# EAGLE design MP5x16_V1.0 (EAGLE 9.2.2)
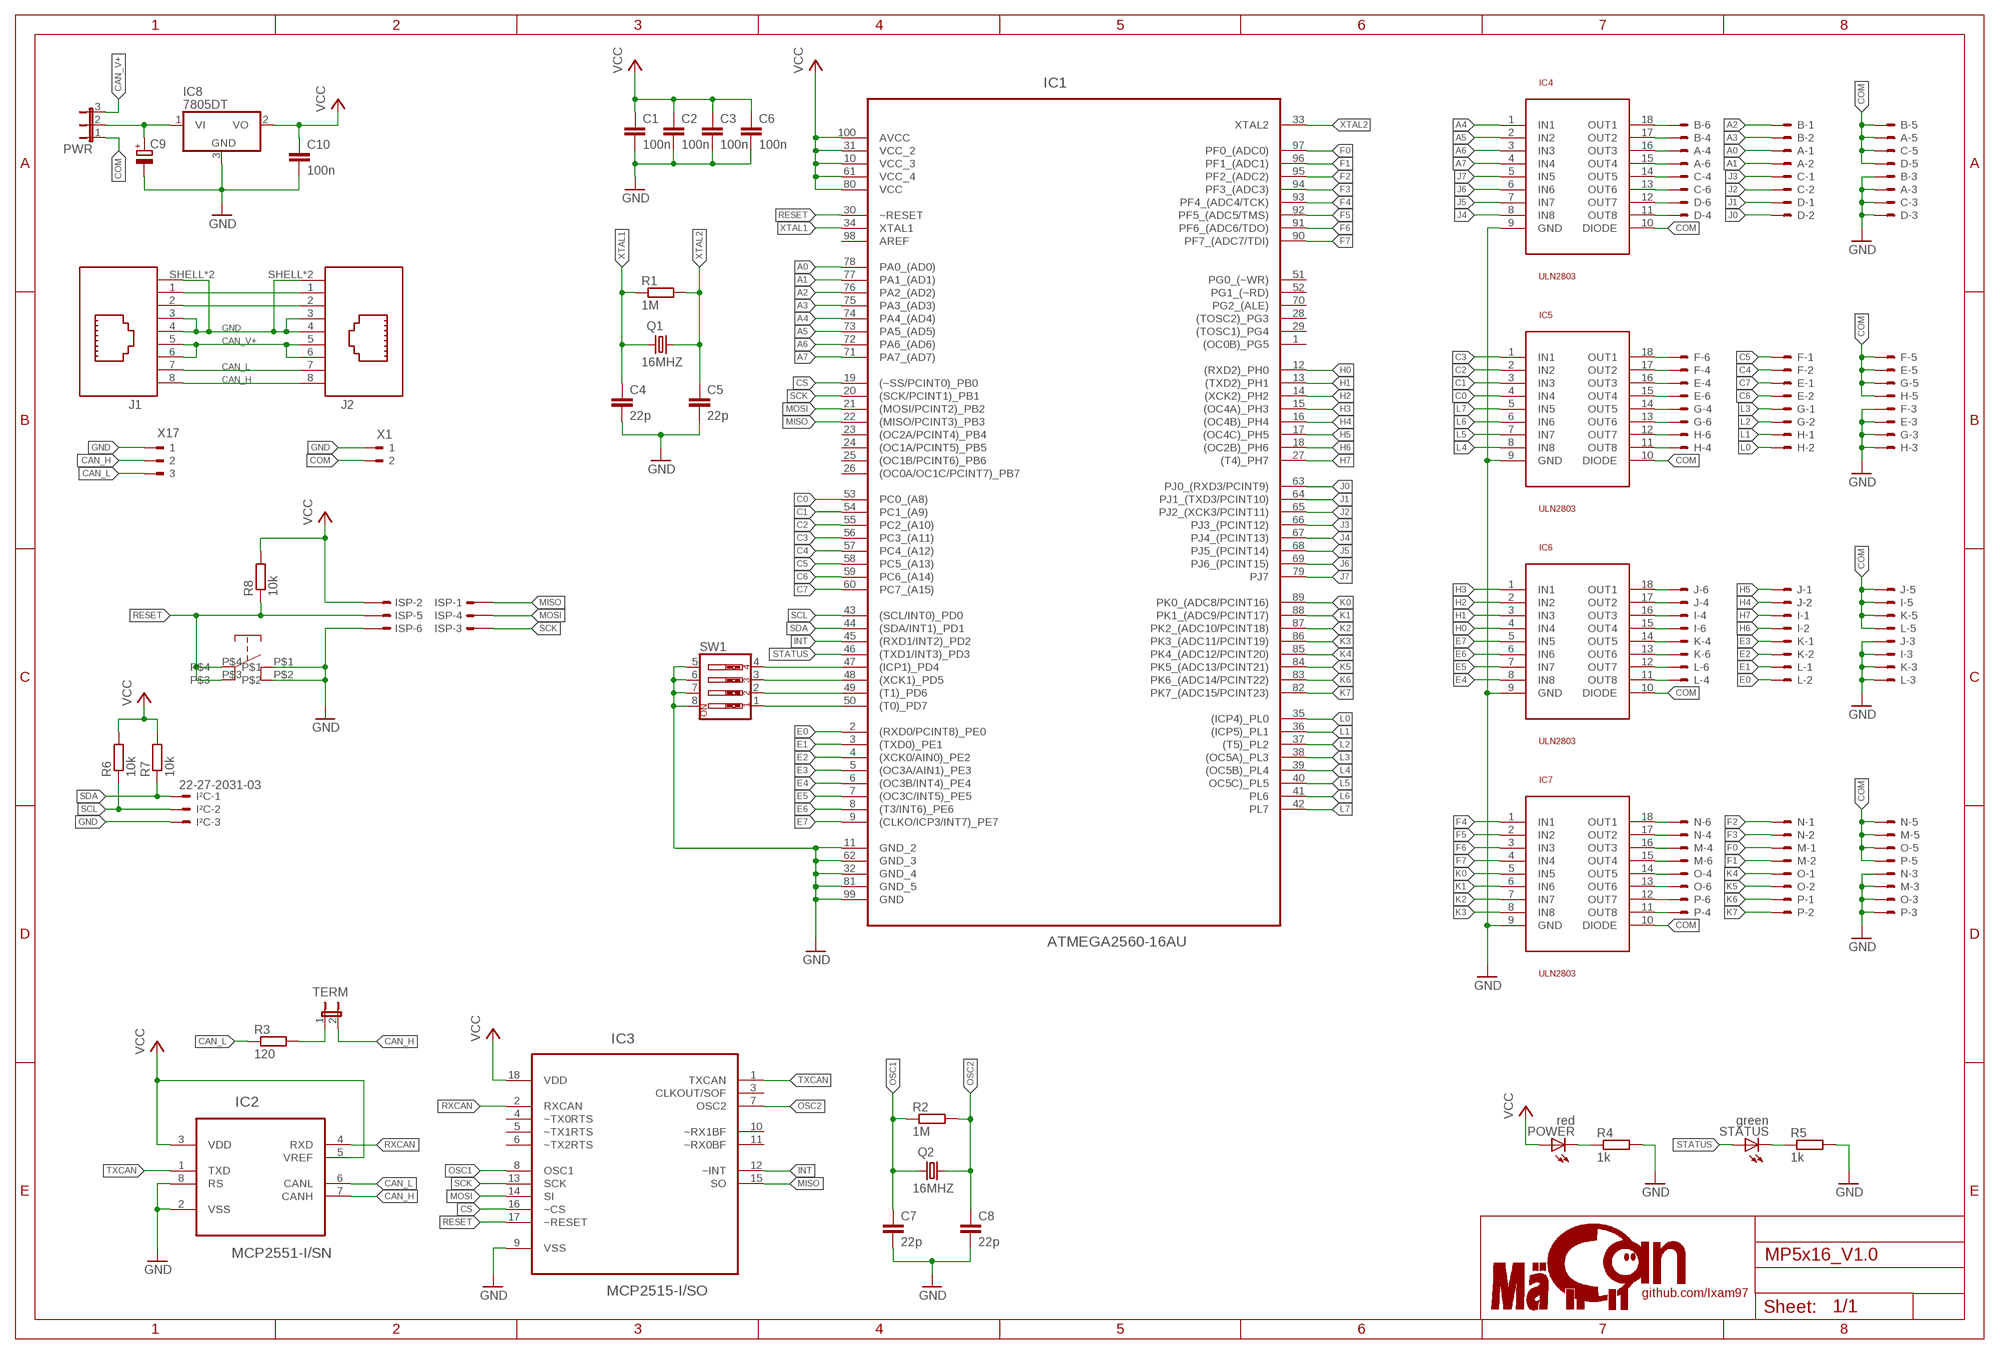
[diagram p0: schematic, sheet 1]

## Parts
A  22-27-2061-06  [6410-06]
B  22-27-2061-06  [6410-06]
C  22-27-2061-06  [6410-06]
C1  100n  C-EUC0402  [C0402]
C2  100n  C-EUC0402  [C0402]
C3  100n  C-EUC0402  [C0402]
C4  22p  C-EUC0402  [C0402]
C5  22p  C-EUC0402  [C0402]
C6  100n  C-EUC0402  [C0402]
C7  22p  C-EUC0402  [C0402]
C8  22p  C-EUC0402  [C0402]
C9  CPOL-EUCT3216  [CT3216]
C10  100n  C-EUC0402  [C0402]
D  22-27-2061-06  [6410-06]
E  22-27-2061-06  [6410-06]
F  22-27-2061-06  [6410-06]
G  22-27-2061-06  [6410-06]
H  22-27-2061-06  [6410-06]
I  22-27-2061-06  [6410-06]
IC1  ATMEGA2560-16AU  [QFP50P1600X1600X120-100N]
IC2  MCP2551-I/SN  [SOIC127P600X175-8N]
IC3  MCP2515-I/SO  [SOIC127P1034X264-18N]
IC4  ULN2803  [SO18L]
IC5  ULN2803  [SO18L]
IC6  ULN2803  [SO18L]
IC7  ULN2803  [SO18L]
IC8  7805DT  [TO252]
ISP  057-006-1  [057-006-1]
I²C  22-27-2031-03  [6410-03]
J  22-27-2061-06  [6410-06]
J1  615008140421  [615008140421]
J2  615008140421  [615008140421]
K  22-27-2061-06  [6410-06]
L  22-27-2061-06  [6410-06]
M  22-27-2061-06  [6410-06]
N  22-27-2061-06  [6410-06]
O  22-27-2061-06  [6410-06]
P  22-27-2061-06  [6410-06]
POWER  red  LEDCHIP-LED0805  [CHIP-LED0805]
PWR  JP2E  [JP2]
Q1  16MHZ  KX-7  [3.2X2.5_KX-7]
Q2  16MHZ  KX-7  [3.2X2.5_KX-7]
R1  1M  R-EU_R0402  [R0402]
R2  1M  R-EU_R0402  [R0402]
R3  120  R-EU_R0402  [R0402]
R4  1k  R-EU_R0402  [R0402]
R5  1k  R-EU_R0402  [R0402]
R6  10k  R-EU_R0402  [R0402]
R7  10k  R-EU_R0402  [R0402]
R8  10k  R-EU_R0402  [R0402]
STATUS  green  LEDCHIP-LED0805  [CHIP-LED0805]
SW1  SW_DIP-4  [EDG-04]
TERM  JP1E  [JP1]
U$1  LOGO  [LOGO]
U$15  BUTTON_JLC  [BUTTON]
X1  180-2  [180-2]
X17  180-3  [180-3]

## Nets
A0: A.1 IC1.78(PA0_(AD0))
A1: A.2 IC1.77(PA1_(AD1))
A2: B.1 IC1.76(PA2_(AD2))
A3: B.2 IC1.75(PA3_(AD3))
A4: IC1.74(PA4_(AD4)) IC4.1(IN1)
A5: IC1.73(PA5_(AD5)) IC4.2(IN2)
A6: IC1.72(PA6_(AD6)) IC4.3(IN3)
A7: IC1.71(PA7_(AD7)) IC4.4(IN4)
C0: IC1.53(PC0_(A8)) IC5.4(IN4)
C1: IC1.54(PC1_(A9)) IC5.3(IN3)
C2: IC1.55(PC2_(A10)) IC5.2(IN2)
C3: IC1.56(PC3_(A11)) IC5.1(IN1)
C4: F.2 IC1.57(PC4_(A12))
C5: F.1 IC1.58(PC5_(A13))
C6: E.2 IC1.59(PC6_(A14))
C7: E.1 IC1.60(PC7_(A15))
CAN_H: IC2.7(CANH) J1.8 J2.8 TERM.2 X17.2
CAN_L: IC2.6(CANL) J1.7 J2.7 R3.1 X17.3
CAN_V+: J1.5 J1.6 J2.5 J2.6 PWR.3
COM: A.5 B.5 C.5 D.5 E.5 F.5 G.5 H.5 I.5 IC4.10(DIODE) IC5.10(DIODE) IC6.10(DIODE) IC7.10(DIODE) J.5 K.5 L.5 M.5 N.5 O.5 P.5 PWR.1 X1.2
CS: IC1.19((~SS/PCINT0)_PB0) IC3.16(~CS)
E0: IC1.2((RXD0/PCINT8)_PE0) L.2
E1: IC1.3((TXD0)_PE1) L.1
E2: IC1.4((XCK0/AIN0)_PE2) K.2
E3: IC1.5((OC3A/AIN1)_PE3) K.1
E4: IC1.6((OC3B/INT4)_PE4) IC6.8(IN8)
E5: IC1.7((OC3C/INT5)_PE5) IC6.7(IN7)
E6: IC1.8((T3/INT6)_PE6) IC6.6(IN6)
E7: IC1.9((CLKO/ICP3/INT7)_PE7) IC6.5(IN5)
F0: IC1.97(PF0_(ADC0)) M.1
F1: IC1.96(PF1_(ADC1)) M.2
F2: IC1.95(PF2_(ADC2)) N.1
F3: IC1.94(PF3_(ADC3)) N.2
F4: IC1.93(PF4_(ADC4/TCK)) IC7.1(IN1)
F5: IC1.92(PF5_(ADC5/TMS)) IC7.2(IN2)
F6: IC1.91(PF6_(ADC6/TDO)) IC7.3(IN3)
F7: IC1.90(PF7_(ADC7/TDI)) IC7.4(IN4)
GND: A.3 B.3 C1.2 C2.2 C3.2 C4.2 C5.2 C6.2 C7.2 C8.2 C9.- C10.2 C.3 D.3 E.3 F.3 G.3 H.3 I.3 IC1.11(GND_2) IC1.32(GND_4) IC1.62(GND_3) IC1.81(GND_5) IC1.99(GND) IC2.2(VSS) IC2.8(RS) IC3.9(VSS) IC4.9(GND) IC5.9(GND) IC6.9(GND) IC7.9(GND) IC8.3(GND) ISP.6 I²C.3 J1.3 J1.4 J1.SHELL1(SHIELD) J1.SHELL(SHIELD) J2.3 J2.4 J2.SHELL1(SHIELD) J2.SHELL(SHIELD) J.3 K.3 L.3 M.3 N.3 O.3 P.3 R4.2 R5.2 SW1.5 SW1.6 SW1.7 SW1.8 U$15.P$1 U$15.P$2 X1.1 X17.1
H0: IC1.12((RXD2)_PH0) IC6.4(IN4)
H1: IC1.13((TXD2)_PH1) IC6.3(IN3)
H2: IC1.14((XCK2)_PH2) IC6.2(IN2)
H3: IC1.15((OC4A)_PH3) IC6.1(IN1)
H4: IC1.16((OC4B)_PH4) J.2
H5: IC1.17((OC4C)_PH5) J.1
H6: I.2 IC1.18((OC2B)_PH6)
H7: I.1 IC1.27((T4)_PH7)
INT: IC1.45((RXD1/INT2)_PD2) IC3.12(~INT)
J0: D.2 IC1.63(PJ0_(RXD3/PCINT9))
J1: D.1 IC1.64(PJ1_(TXD3/PCINT10))
J2: C.2 IC1.65(PJ2_(XCK3/PCINT11))
J3: C.1 IC1.66(PJ3_(PCINT12))
J4: IC1.67(PJ4_(PCINT13)) IC4.8(IN8)
J5: IC1.68(PJ5_(PCINT14)) IC4.7(IN7)
J6: IC1.69(PJ6_(PCINT15)) IC4.6(IN6)
J7: IC1.79(PJ7) IC4.5(IN5)
K0: IC1.89(PK0_(ADC8/PCINT16)) IC7.5(IN5)
K1: IC1.88(PK1_(ADC9/PCINT17)) IC7.6(IN6)
K2: IC1.87(PK2_(ADC10/PCINT18)) IC7.7(IN7)
K3: IC1.86(PK3_(ADC11/PCINT19)) IC7.8(IN8)
K4: IC1.85(PK4_(ADC12/PCINT20)) O.1
K5: IC1.84(PK5_(ADC13/PCINT21)) O.2
K6: IC1.83(PK6_(ADC14/PCINT22)) P.1
K7: IC1.82(PK7_(ADC15/PCINT23)) P.2
L0: H.2 IC1.35((ICP4)_PL0)
L1: H.1 IC1.36((ICP5)_PL1)
L2: G.2 IC1.37((T5)_PL2)
L3: G.1 IC1.38((OC5A)_PL3)
L4: IC1.39((OC5B)_PL4) IC5.8(IN8)
L5: IC1.40(OC5C)_PL5) IC5.7(IN7)
L6: IC1.41(PL6) IC5.6(IN6)
L7: IC1.42(PL7) IC5.5(IN5)
MISO: IC1.22((MISO/PCINT3)_PB3) IC3.15(SO) ISP.1
MOSI: IC1.21((MOSI/PCINT2)_PB2) IC3.14(SI) ISP.4
N$1: B.4 IC4.17(OUT2)
N$2: B.6 IC4.18(OUT1)
N$3: A.4 IC4.16(OUT3)
N$4: A.6 IC4.15(OUT4)
N$5: C.4 IC4.14(OUT5)
N$6: C.6 IC4.13(OUT6)
N$7: D.6 IC4.12(OUT7)
N$8: D.4 IC4.11(OUT8)
N$9: F.6 IC5.18(OUT1)
N$10: F.4 IC5.17(OUT2)
N$11: E.6 IC5.15(OUT4)
N$12: E.4 IC5.16(OUT3)
N$13: G.4 IC5.14(OUT5)
N$14: G.6 IC5.13(OUT6)
N$15: H.6 IC5.12(OUT7)
N$16: H.4 IC5.11(OUT8)
N$17: IC1.47((ICP1)_PD4) SW1.4
N$18: IC1.48((XCK1)_PD5) SW1.3
N$19: IC1.49((T1)_PD6) SW1.2
N$20: IC1.50((T0)_PD7) SW1.1
N$21: J1.1 J2.1
N$23: IC6.12(OUT7) L.6
N$24: IC7.12(OUT7) P.6
N$25: IC6.11(OUT8) L.4
N$26: I.4 IC6.16(OUT3)
N$27: I.6 IC6.15(OUT4)
N$28: IC6.14(OUT5) K.4
N$29: IC6.13(OUT6) K.6
N$30: IC6.17(OUT2) J.4
N$31: IC6.18(OUT1) J.6
N$32: IC7.11(OUT8) P.4
N$33: IC7.17(OUT2) N.4
N$34: IC7.16(OUT3) M.4
N$35: IC7.15(OUT4) M.6
N$36: IC7.14(OUT5) O.4
N$37: IC7.13(OUT6) O.6
N$38: IC7.18(OUT1) N.6
N$39: J1.2 J2.2
N$133: POWER.C R4.1
N$134: R3.2 TERM.1
N$137: R5.1 STATUS.C
OSC1: C7.1 IC3.8(OSC1) Q2.1 R2.1
OSC2: C8.1 IC3.7(OSC2) Q2.3 R2.2
RESET: IC1.30(~RESET) IC3.17(~RESET) ISP.5 R8.1 U$15.P$3 U$15.P$4
RXCAN: IC2.4(RXD) IC3.2(RXCAN)
SCK: IC1.20((SCK/PCINT1)_PB1) IC3.13(SCK) ISP.3
SCL: IC1.43((SCL/INT0)_PD0) I²C.2 R6.1
SDA: IC1.44((SDA/INT1)_PD1) I²C.1 R7.1
STATUS: IC1.46((TXD1/INT3)_PD3) STATUS.A
TXCAN: IC2.1(TXD) IC3.1(TXCAN)
V+: C9.+ IC8.1(VI) PWR.2
VCC: C1.1 C2.1 C3.1 C6.1 C10.1 IC1.10(VCC_3) IC1.31(VCC_2) IC1.61(VCC_4) IC1.80(VCC) IC1.100(AVCC) IC2.3(VDD) IC2.5(VREF) IC3.18(VDD) IC8.2(VO) ISP.2 POWER.A R6.2 R7.2 R8.2
XTAL1: C4.1 IC1.34(XTAL1) Q1.1 R1.1
XTAL2: C5.1 IC1.33(XTAL2) Q1.3 R1.2
Unconnected: IC1.1((OC0B)_PG5) IC1.23((OC2A/PCINT4)_PB4) IC1.24((OC1A/PCINT5)_PB5) IC1.25((OC1B/PCINT6)_PB6) IC1.26((OC0A/OC1C/PCINT7)_PB7) IC1.28((TOSC2)_PG3) IC1.29((TOSC1)_PG4) IC1.51(PG0_(~WR)) IC1.52(PG1_(~RD)) IC1.70(PG2_(ALE)) IC1.98(AREF) IC3.3(CLKOUT/SOF) IC3.4(~TX0RTS) IC3.5(~TX1RTS) IC3.6(~TX2RTS) IC3.10(~RX1BF) IC3.11(~RX0BF)

## Library data of the parts
A B C D E F G H I J K L M N O P = con-molex:22-?-06: CONNECTOR wire to board 2.54 mm (.1 inch) pitch header; MF: MOLEX; OC_FARNELL: unknown; OC_NEWARK: unknown
C1-C8 C10 = rcl:C-EU: CAPACITOR, European symbol; SPICEPREFIX: C
C9 = rcl:CPOL-EU: POLARIZED CAPACITOR, European symbol; SPICEPREFIX: C
IC1 = ATMEGA2560-16AU:ATMEGA2560-16AU: Microcontroller; AVAILABILITY: Unavailable; DESCRIPTION: AVR AVR® ATmega Microcontroller IC 8-Bit 16MHz 256KB _128K x 16_ FLASH 100-TQFP _14x14_; MF: Microchip; MP: ATMEGA2560-16AU; PACKAGE: TQFP-100 Adesto Technologies; PRICE: None
IC2 = Microchip_By_element14_Batch_1:MCP2551-I/SN: High-Speed CAN Transceiver; MPN: MCP2551-I/SN; OC_FARNELL: 9758569; OC_NEWARK: 69K7604; PACKAGE: SOIC-8; SUPPLIER: Microchip
IC3 = Microchip_By_element14_Batch_1:MCP2515-I/SO: CAN Controller; MPN: MCP2515-I/SO; OC_FARNELL: 1292239; OC_NEWARK: 29H7136; PACKAGE: SOIC-18; SUPPLIER: Microchip
IC4-IC7 = uln2803:ULN2803
IC8 = linear:78*: Positive VOLTAGE REGULATOR Source: http://cache.national.com/ds/LM/LM78L05.pdf http://www.fairchildsemi.com/ds/LM/LM7805.pdf
ISP = con-panduit:057-006-: CONNECTOR 6-pin series 057 contact pc board low profile headers; OC_FARNELL: unknown; OC_NEWARK: unknown
I²C = con-molex:22-?-03: CONNECTOR wire to board 2.54 mm (.1 inch) pitch header; MF: MOLEX; OC_FARNELL: unknown; OC_NEWARK: unknown
J1 J2 = InputOutputIO (rev18b):615008140421: WR-MJ Vertical Shielded 8P8C Rear Post Modular Jack, 8 pins=>Code : Con_I-O_MJ-V_Shielded_615008140421 <http://katalog.we-online.de/media/images/eican/Con_I-O_MJ-V_Shielded_615008140421_pf2.jpg> Details see: http://katalog.we-online.de/en/em/615_008_140_421 Created 2014-07-10, Karrer Zheng 2014 (C) Würth Elektronik
POWER STATUS = led:LED: LED OSRAM: - CHIPLED LG R971, LG N971, LY N971, LG Q971, LY Q971, LO R971, LY R971 LH N974, LH R974 LS Q976, LO Q976, LY Q976 LO Q996 - Hyper CHIPLED LW Q18S LB Q993, LB Q99A, LB R99A - SideLED LS A670, LO A670, LY A670, LG A670, LP A670 LB A673, LV A673, LT A673, LW A673 LH A674 LY A675 LS A676, LA A676, LO A676, LY A676, LW A676 LS A679, LY A679, LG A679 - Hyper Micro SIDELED® LS Y876, LA Y876, LO Y876, LY Y876 LT Y87S - SmartLED LW L88C, LW L88S LB L89C, LB L89S, LG L890 LS L89K, LO L89K, LY L89K LS L896, LA L896, LO L896, LY L896 - TOPLED LS T670, LO T670, LY T670, LG T670, LP T670 LSG T670, LSP T670, LSY T670, LOP T670, LYG T670 LG T671, LOG T671, LSG T671 LB T673, LV T673, LT T673, LW T673 LH T674 LS T676, LA T676, LO T676, LY T676, LB T676, LH T676, LSB T676, LW T676 LB T67C, LV T67C, LT T67C, LS T67K, LO T67K, LY T67K, LW E67C LS E67B, LA E67B, LO E67B, LY E67B, LB E67C, LV E67C, LT E67C LW T67C LS T679, LY T679, LG T679 LS T770, LO T770, LY T770, LG T770, LP T770 LB T773, LV T773, LT T773, LW T773 LH T774 LS E675, LA E675, LY E675, LS T675 LS T776, LA T776, LO T776, LY T776, LB T776 LHGB T686 LT T68C, LB T68C - Hyper Mini TOPLED® LB M676 - Mini TOPLED Santana® LG M470 LS M47K, LO M47K, LY M47K Source: http://www.osram.convergy.de LUXEON: - LUMILED® LXK2-PW12-R00, LXK2-PW12-S00, LXK2-PW14-U00, LXK2-PW14-V00 LXK2-PM12-R00, LXK2-PM12-S00, LXK2-PM14-U00 LXK2-PE12-Q00, LXK2-PE12-R00, LXK2-PE12-S00, LXK2-PE14-T00, LXK2-PE14-U00 LXK2-PB12-K00, LXK2-PB12-L00, LXK2-PB12-M00, LXK2-PB14-N00, LXK2-PB14-P00, LXK2-PB14-Q00 LXK2-PR12-L00, LXK2-PR12-M00, LXK2-PR14-Q00, LXK2-PR14-R00 LXK2-PD12-Q00, LXK2-PD12-R00, LXK2-PD12-S00 LXK2-PH12-R00, LXK2-PH12-S00 LXK2-PL12-P00, LXK2-PL12-Q00, LXK2-PL12-R00 Source: www.luxeon.com KINGBRIGHT: KA-3528ASYC Source: www.kingbright.com
PWR = jumper:JP2E: JUMPER
Q1 Q2 = crystal-geyer_V1_0:KX: Quartz Crystals (MHz) SMD: KX - Serie Model Size l/w/h [mm] Frequency Range Frequency Stability Temp. Range [°C] Load Capacitance AECQ 200 availabel Datasheet KX-4 KX-5 KX-6 KX-7 KX-9A KX-9B KX-12A KX-12B KX-13 KX-20 KX-K KX-KS 1.6/1.2/0.3 2.0/1.6/0.45 2.5/2.0/0.55 3.2/2.5/0.8 5.0/3.2/1.0 5.0/3.2/1.1 6.0/3.5/1.1 6.0/3.5/1.0 7.0/5.0 /1.3 11.6/5.5/1.6 12.3/4.5/4.2 12.3/4.5/3.2 24.0 ~ 80.0 MHz 16.0 ~ 80.0 MHz 12.0 ~ 80.0 MHz 8.0 ~ 60.0 MHz 7,68 ~ 300,0 MHz 8,0 ~ 50,0 MHz 8,0 ~ 150,0 MHz 8,0 ~ 50,0 MHz 6,0 ~ 160,0 MHz 3,579 ~ 25,0 MHz 3,579 ~ 70,0 MHz 3,579 ~ 70,0 MHz ±10 … ±50ppm ±10 … ±50ppm ±10 … ±50ppm ±10 … ±50ppm ±10 … ±50ppm ±10 … ±50ppm ±10 … ±50ppm ±10 … ±50ppm ±10 … ±50ppm ±50ppm ±10 … ±50ppm ±10 … ±50ppm (*) -40°C …+85°C (*) -40°C …+125°C (*) -40°C …+125°C (*) -40°C …+125°C (*) -40°C …+105°C (*) -40°C …+105°C (*) -40°C …+125°C (*) -40°C …+105°C (*) -40°C …+105°C (*) -40°C …+105°C (*) -40°C …+85°C (*) -40°C …+85°C 8, 8…16 8, 8…16 10, 8…16 12, 7…20 16, 10…20 16, 10…20 16, 10…20 16, 12…20 16, 12…20 16, 12…20 16, 12…30 16, 12…30 - yes yes yes - - - - - - - - KX-4.pdf <http://www.geyer-electronic.de/uploads/tx_userartikelfrequenz/GEYER-KX-4.pdf> KX-5.pdf <http://www.geyer-electronic.de/uploads/tx_userartikelfrequenz/GEYER-KX-5.pdf> KX-6.pdf <http://www.geyer-electronic.de/uploads/tx_userartikelfrequenz/GEYER-KX-6.pdf> KX-7.pdf <http://www.geyer-electronic.de/uploads/tx_userartikelfrequenz/GEYER-KX-7.pdf> KX-9A.pdf <http://www.geyer-electronic.de/uploads/tx_userartikelfrequenz/GEYER-KX-9A.pdf> KX-9B.pdf <http://www.geyer-electronic.de/uploads/tx_userartikelfrequenz/GEYER-KX-9B.pdf> KX-12A.pdf <http://www.geyer-electronic.de/uploads/tx_userartikelfrequenz/GEYER-KX-12A.pdf> KX-12B.pdf <http://www.geyer-electronic.de/uploads/tx_userartikelfrequenz/GEYER-KX-12B.pdf> KX-13.pdf <http://www.geyer-electronic.de/uploads/tx_userartikelfrequenz/GEYER-KX-13.pdf> KX-20.pdf <http://www.geyer-electronic.de/uploads/tx_userartikelfrequenz/GEYER-KX-20.pdf> KX-K.pdf <http://www.geyer-electronic.de/uploads/tx_userartikelfrequenz/GEYER-KX-K.pdf> KX-KS.pdf <http://www.geyer-electronic.de/uploads/tx_userartikelfrequenz/GEYER-KX-KS.pdf> <http://www.geyer-electronic.de/fileadmin/template/img/logo-geyer-electronic.png> Details see: http://www.geyer-electronic.de/Frequenz-Produkte.9.0.html Created 2016-06-07, Hans Locher 2016 (C) Geyer Quartz Technology KX4,KX5,KX6,KX7,KX9A,KX9B,KX12A,KX12B,KX13,KX20,KXK,KXKS;1612;2016;2520;3225;5032;6035;7050;11655;12345;1,6x1,2;2,0x1,6;2,5x2,0;3,2x2,5;5,0x3,2;6,0x3,5;7,0x5,0;11,6x5,5;12,3x4,5;12,3x4,5;1.6x1.2;2.0x1.6;2.5x2.0;3.2x2.5;5.0x3.2;6.0x3.5;7.0x5.0;11.6x5.5;12.3x4.5;12.3x4.5;
R1-R8 = rcl:R-EU_: RESISTOR, European symbol; SPICEPREFIX: R
SW1 = special:SW_DIP-4: DIP SWITCH
TERM = jumper:JP1E: JUMPER
U$1 = MaeCAN_logo:LOGO
U$15 = MaeCAN_logo:BUTTON_JLC
X1 = con-weidmueller-sl35:180-2: WEIDMUELLER CLAMP CONNECTOR; OC_FARNELL: unknown; OC_NEWARK: unknown
X17 = con-weidmueller-sl35:180-3: WEIDMUELLER CLAMP CONNECTOR; OC_FARNELL: unknown; OC_NEWARK: unknown

## Board
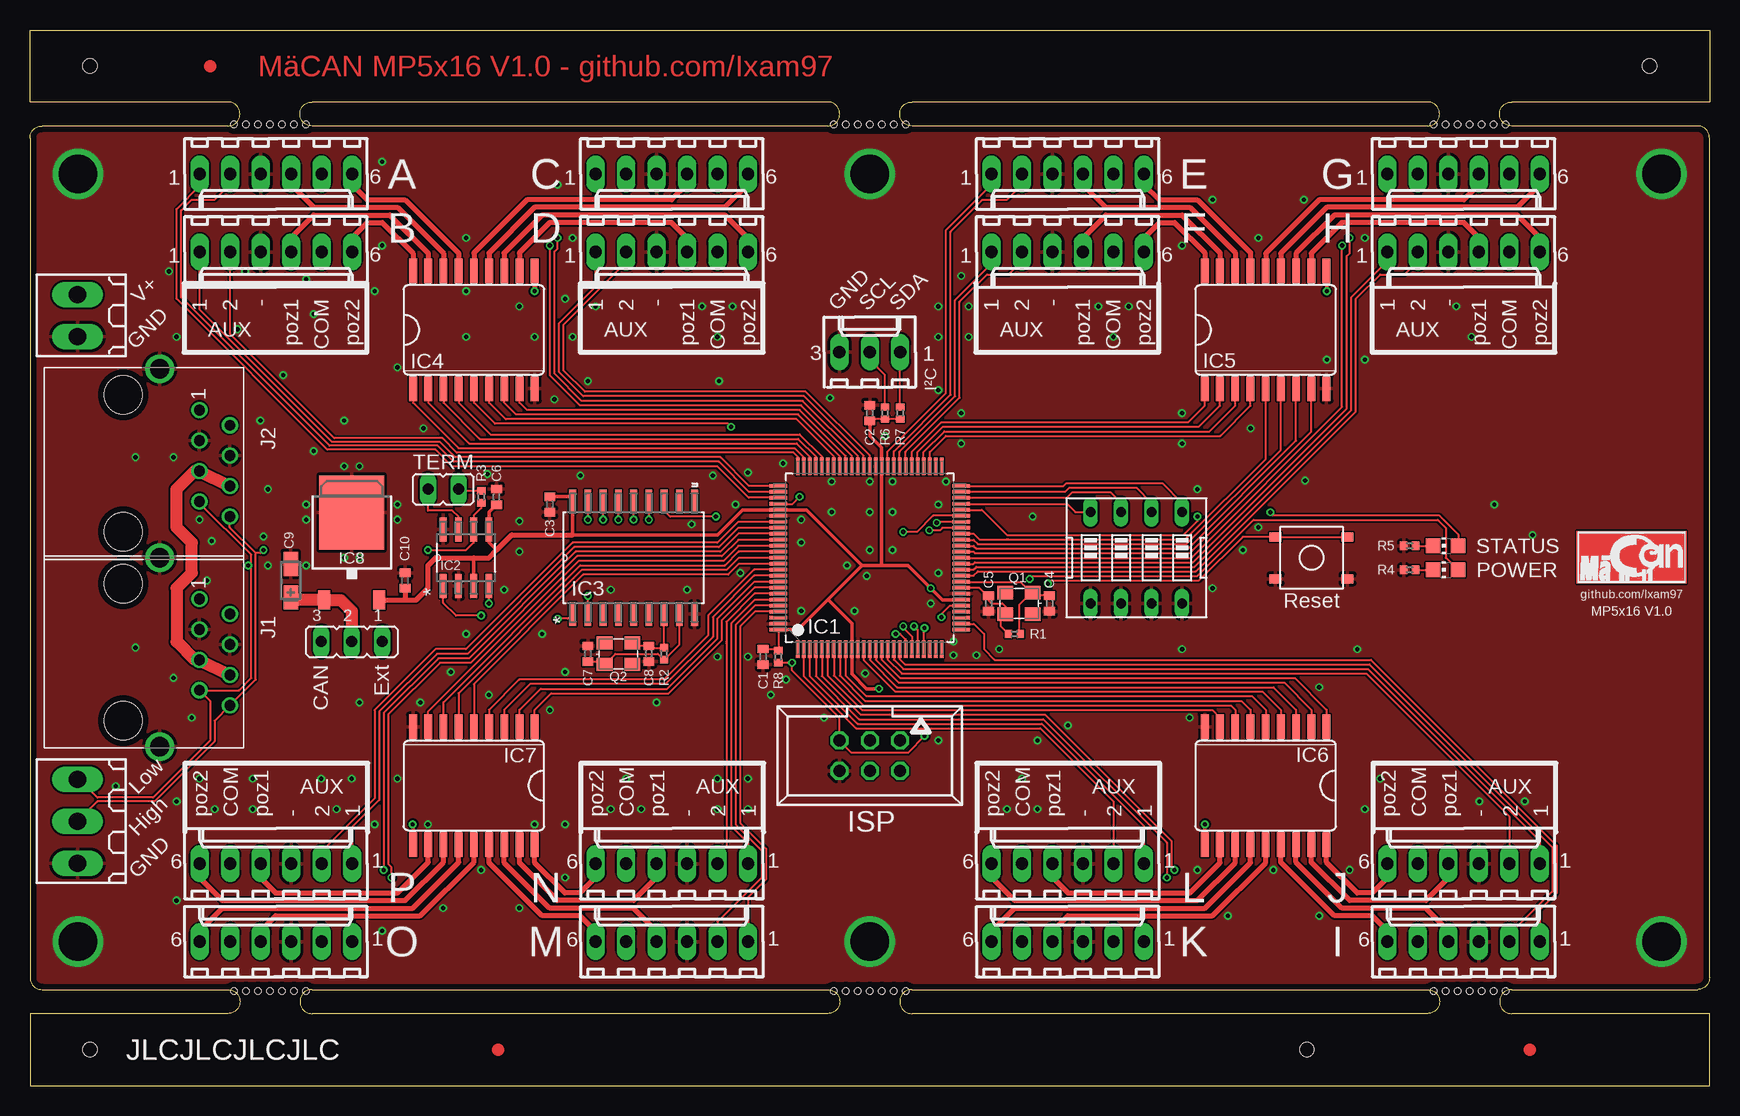
[diagram p1: board, top side]
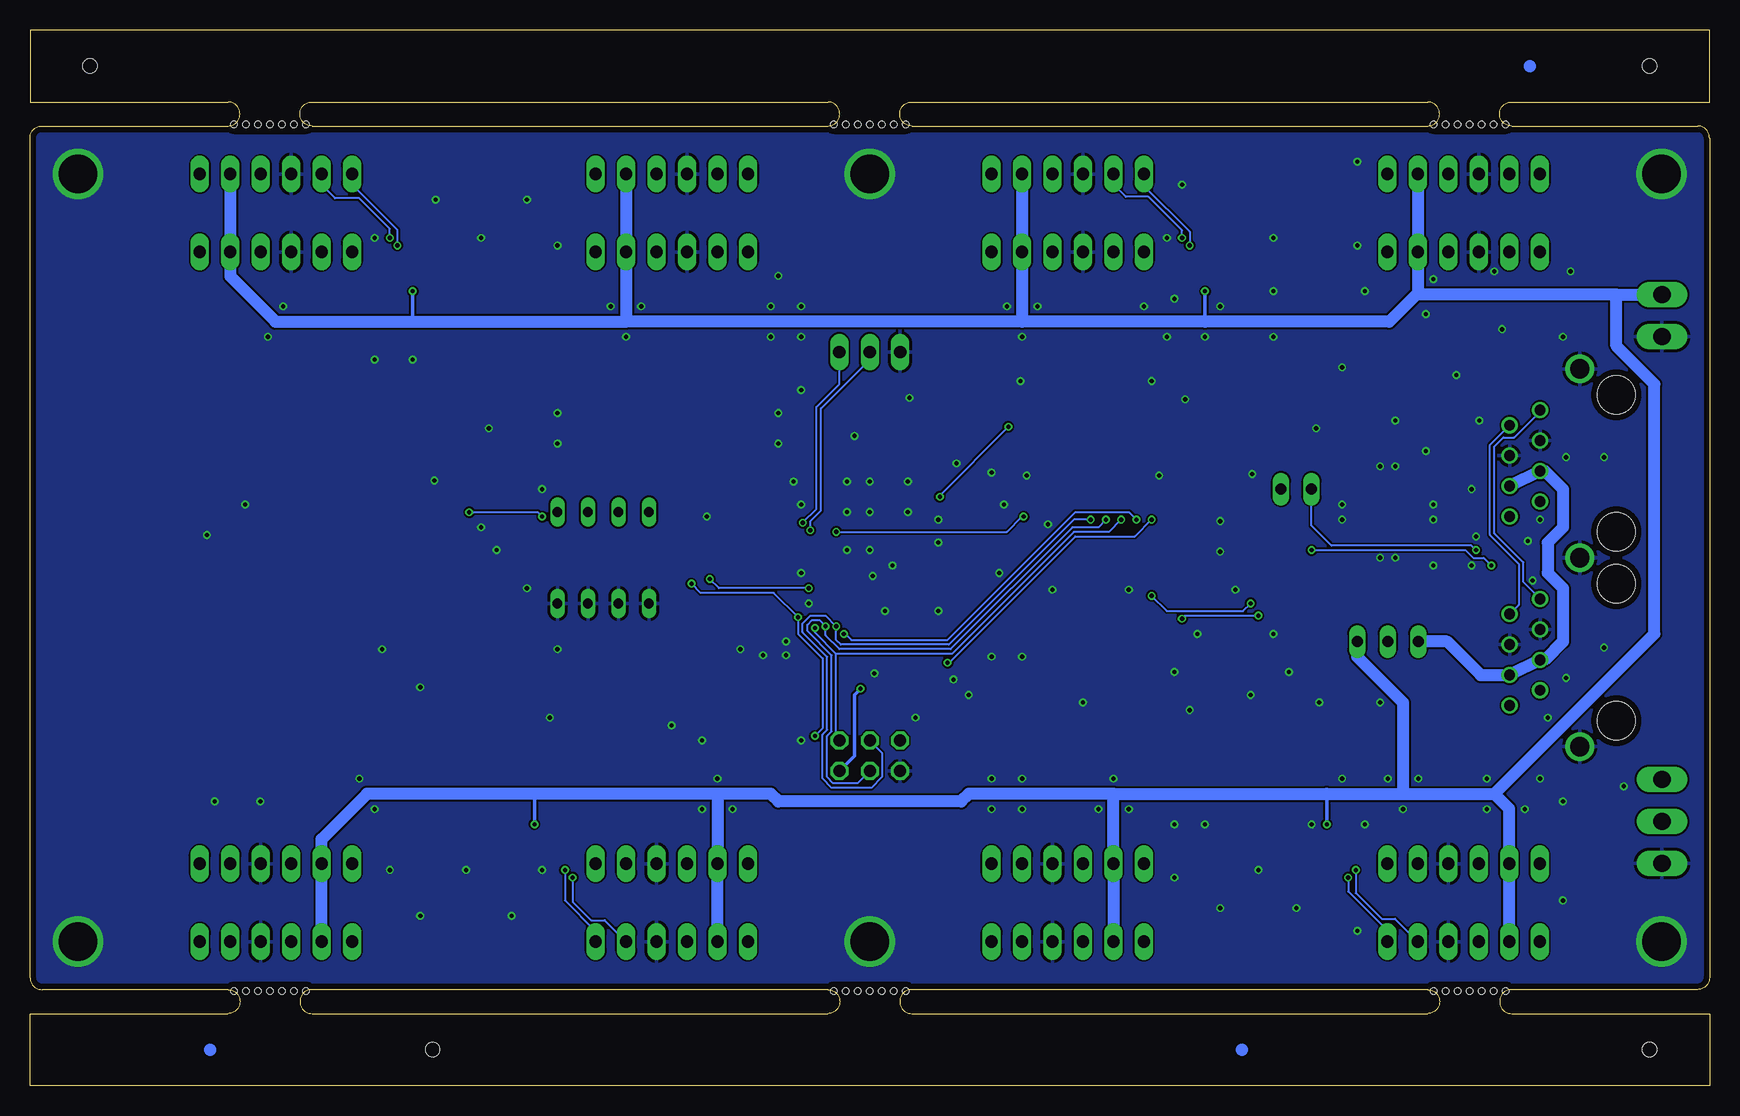
[diagram p2: board, bottom side, seen from below]

Size 140 x 88 mm. Coordinates in mm from the lower left corner, seen from the top.
Outline: 1,8 16.5,8 arc-90 17.5,7 arc-90 16.5,6 0,6 0,0 140,0 140,6 123.5,6 arc-90 122.5,7 arc-90 123.5,8 139,8 arc90 140,9 140,79 arc90 139,80 123.5,80 arc-90 122.5,81 arc-90 123.5,82 140,82 140,88 0,88 0,82 16.5,82 arc-90 17.5,81 arc-90 16.5,80 1,80 arc90 0,79 0,9 arc90 1,8
Outline: 23.5,8 66.5,8 arc-90 67.5,7 arc-90 66.5,6 23.5,6 arc-90 22.5,7 arc-90 23.5,8
Outline: 73.5,8 116.5,8 arc-90 117.5,7 arc-90 116.5,6 73.5,6 arc-90 72.5,7 arc-90 73.5,8
Outline: 116.5,80 73.5,80 arc-90 72.5,81 arc-90 73.5,82 116.5,82 arc-90 117.5,81 arc-90 116.5,80
Outline: 66.5,80 23.5,80 arc-90 22.5,81 arc-90 23.5,82 66.5,82 arc-90 67.5,81 arc-90 66.5,80
Copper layers (1*16): Top 0.035mm / dielectric 1.6mm / Bottom 0.035mm
Design rules "Elecrow_2-layer_PCB_eagle_rule": minimum track width 6mil, minimum drill 12mil, track to track 6mil, track to pad 6mil, pad to pad 6mil, via to via 8mil, smd to smd 0mil, copper to edge 20mil, drill to drill 10mil, minimum pad ring 6mil, minimum via ring 6mil, stop-mask expansion 0mil, vias tented up to drill 100mil, thermal gap 10mil

### Footprints (pad centres in the part's own frame; a part is rotated, then mirrored left to right if it is on the bottom)
6410-06 = drill 1.016 long: 1 6.35,0; 2 3.81,0; 3 1.27,0; 4 -1.27,0; 5 -3.81,0; 6 -6.35,0
C0402 = smd 0.7 x 0.9: 1 -0.65,0; 2 0.65,0
CT3216 = smd 2 x 1.2: + -1.4,0; - 1.4,0
QFP50P1600X1600X120-100N = smd 1.473 x 0.279: 1 -7.62,5.994; 2 -7.62,5.512; 3 -7.62,5.004; 4 -7.62,4.496; 5 -7.62,3.988; 6 -7.62,3.505; 7 -7.62,2.997; 8 -7.62,2.489; 9 -7.62,2.007; 10 -7.62,1.499; 11 -7.62,0.991; 12 -7.62,0.508; 13 -7.62,0; 14 -7.62,-0.508; 15 -7.62,-0.991; 16 -7.62,-1.499; 17 -7.62,-2.007; 18 -7.62,-2.489; 19 -7.62,-2.997; 20 -7.62,-3.505; 21 -7.62,-3.988; 22 -7.62,-4.496; 23 -7.62,-5.004; 24 -7.62,-5.512; 25 -7.62,-5.994; 51 7.62,-5.994; 52 7.62,-5.512; 53 7.62,-5.004; 54 7.62,-4.496; 55 7.62,-3.988; 56 7.62,-3.505; 57 7.62,-2.997; 58 7.62,-2.489; 59 7.62,-2.007; 60 7.62,-1.499; 61 7.62,-0.991; 62 7.62,-0.508; 63 7.62,0; 64 7.62,0.508; 65 7.62,0.991; 66 7.62,1.499; 67 7.62,2.007; 68 7.62,2.489; 69 7.62,2.997; 70 7.62,3.505; 71 7.62,3.988; 72 7.62,4.496; 73 7.62,5.004; 74 7.62,5.512; 75 7.62,5.994 | smd 0.279 x 1.473: 26 -5.994,-7.62; 27 -5.512,-7.62; 28 -5.004,-7.62; 29 -4.496,-7.62; 30 -3.988,-7.62; 31 -3.505,-7.62; 32 -2.997,-7.62; 33 -2.489,-7.62; 34 -2.007,-7.62; 35 -1.499,-7.62; 36 -0.991,-7.62; 37 -0.508,-7.62; 38 0,-7.62; 39 0.508,-7.62; 40 0.991,-7.62; 41 1.499,-7.62; 42 2.007,-7.62; 43 2.489,-7.62; 44 2.997,-7.62; 45 3.505,-7.62; 46 3.988,-7.62; 47 4.496,-7.62; 48 5.004,-7.62; 49 5.512,-7.62; 50 5.994,-7.62; 76 5.994,7.62; 77 5.512,7.62; 78 5.004,7.62; 79 4.496,7.62; 80 3.988,7.62; 81 3.505,7.62; 82 2.997,7.62; 83 2.489,7.62; 84 2.007,7.62; 85 1.499,7.62; 86 0.991,7.62; 87 0.508,7.62; 88 0,7.62; 89 -0.508,7.62; 90 -0.991,7.62; 91 -1.499,7.62; 92 -2.007,7.62; 93 -2.489,7.62; 94 -2.997,7.62; 95 -3.505,7.62; 96 -3.988,7.62; 97 -4.496,7.62; 98 -5.004,7.62; 99 -5.512,7.62; 100 -5.994,7.62
SOIC127P600X175-8N = smd 1.981 x 0.559: 1 -2.362,1.905; 2 -2.362,0.635; 3 -2.362,-0.635; 4 -2.362,-1.905; 5 2.362,-1.905; 6 2.362,-0.635; 7 2.362,0.635; 8 2.362,1.905
SOIC127P1034X264-18N = smd 1.981 x 0.559: 1 -4.699,5.08; 2 -4.699,3.81; 3 -4.699,2.54; 4 -4.699,1.27; 5 -4.699,0; 6 -4.699,-1.27; 7 -4.699,-2.54; 8 -4.699,-3.81; 9 -4.699,-5.08; 10 4.699,-5.08; 11 4.699,-3.81; 12 4.699,-2.54; 13 4.699,-1.27; 14 4.699,0; 15 4.699,1.27; 16 4.699,2.54; 17 4.699,3.81; 18 4.699,5.08
SO18L = smd 0.66 x 2.032: 1 -5.08,-4.902; 2 -3.81,-4.902; 3 -2.54,-4.902; 4 -1.27,-4.902; 5 0,-4.902; 6 1.27,-4.902; 7 2.54,-4.902; 8 3.81,-4.902; 9 5.08,-4.902; 10 5.08,4.902; 11 3.81,4.902; 12 2.54,4.902; 13 1.27,4.902; 14 0,4.902; 15 -1.27,4.902; 16 -2.54,4.902; 17 -3.81,4.902; 18 -5.08,4.902
TO252 = smd 1 x 1.6: 1 -2.28,-4.8; 2 2.28,-4.8 | smd 5.4 x 6.2: 3 0,2.5
057-006-1 = drill 1 octagon: 1 -2.54,-1.27; 2 -2.54,1.27; 3 0,-1.27; 4 0,1.27; 5 2.54,-1.27; 6 2.54,1.27
6410-03 = drill 1.016 long: 1 2.54,0; 2 0,0; 3 -2.54,0
615008140421 = drill 0.9: 1 -4.445,-1.27; 2 -3.175,1.27; 3 -1.905,-1.27; 4 -0.635,1.27; 5 0.635,-1.27; 6 1.905,1.27; 7 3.175,-1.27; 8 4.445,1.27 | drill 1.6: SHELL -7.875,-4.57; SHELL1 7.875,-4.57 | hole 3.17: -5.715,-7.62; 5.715,-7.62
CHIP-LED0805 = smd 1.2 x 1.2: A 0,-1.05; C 0,1.05
JP2 = drill 0.914 long: 1 -2.54,0; 2 0,0; 3 2.54,0
3.2X2.5_KX-7 = smd 1.3 x 1.1: 1 -1.15,-0.9; 2 1.15,-0.9; 3 1.15,0.9; 4 -1.15,0.9
R0402 = smd 0.6 x 0.7: 1 -0.5,0; 2 0.5,0
EDG-04 = drill 0.813 long: 1 -3.81,-3.81; 2 -1.27,-3.81; 3 1.27,-3.81; 4 3.81,-3.81; 5 3.81,3.81; 6 1.27,3.81; 7 -1.27,3.81; 8 -3.81,3.81
JP1 = drill 0.914 long: 1 0,-1.27; 2 0,1.27
JLCPCB_TOOLINGHOLE = hole 1.152: 0,0
MOUSEBITESX7 = hole 0.5: 0,0; -1,0; -2,0; 1,0; 2,0; 3,0; -3,0
BUTTON = smd 1 x 0.75: P$1 -3,1.75; P$2 3,1.75; P$3 3,-1.75; P$4 -3,-1.75
180-2 = drill 1.422 long: 1 -1.75,0; 2 1.75,0
180-3 = drill 1.422 long: 1 -3.5,0; 2 0,0; 3 3.5,0

### Placement (x,y rotation side)
A  20.5,76 180 top
B  20.5,69.5 180 top
C  53.5,76 180 top
C1  61.11,35.74 270 top
C2  70,56.06 90 top
C3  43.33,48.45 270 top
C4  84.99,40.19 270 top
C5  79.91,40.19 270 top
C6  38.89,49.08 90 top
C7  46.5,36 90 top
C8  51.59,36 270 top
C9  21.74,42.09 90 top
C10  31.27,42.09 90 top
D  53.5,69.5 180 top
E  86.5,76 180 top
F  86.5,69.5 180 top
G  119.5,76 180 top
H  119.5,69.5 180 top
I  119.5,12 0 top
IC1  70,44 90 top
IC2  36.34,44 90 top
IC3  50.31,44 90 top
IC4  37,63 0 top
IC5  103,63 0 top
IC6  103,25 180 top
IC7  37,25 180 top
IC8  26.82,45.27 0 top
ISP  70,27.49 180 top
I²C  70,61.14 0 top
J  119.5,18.5 0 top
J1  15.39,36.13 270 top
J2  15.39,51.87 270 top
K  86.5,12 0 top
L  86.5,18.5 0 top
M  53.5,12 0 top
N  53.5,18.5 0 top
O  20.5,12 0 top
P  20.5,18.5 0 top
POWER  118,43 90 top
PWR  26.82,37.02 180 top
Q1  82.45,40.19 180 top
Q2  49.05,36 0 top
R1  82.06,37.65 180 top
R2  52.86,36 90 top
R3  37.62,49.08 90 top
R4  115,43 180 top
R5  115,45 180 top
R6  71.27,56.06 270 top
R7  72.54,56.06 270 top
R8  62.38,35.74 90 top
STATUS  118,45 90 top
SW1  92.22,44 180 top
TERM  34.44,49.72 90 top
U$1  129.06,41.97 0 top
U$2  [JLCPCB_TOOLINGHOLE]  5,85 0 top
U$3  [JLCPCB_TOOLINGHOLE]  5,3 0 top
U$4  [JLCPCB_TOOLINGHOLE]  106.42,3 0 top
U$5  [JLCPCB_TOOLINGHOLE]  135,85 0 top
U$6  [FIDUCIAL]  15,85 90 top
U$7  [FIDUCIAL]  125,3 90 top
U$8  [FIDUCIAL]  39,3 90 top
U$9  [MOUSEBITESX7]  70,7.88 0 top
U$10  [MOUSEBITESX7]  120,7.88 0 top
U$11  [MOUSEBITESX7]  20,7.88 0 top
U$12  [MOUSEBITESX7]  20,80.12 0 top
U$13  [MOUSEBITESX7]  70,80.12 0 top
U$14  [MOUSEBITESX7]  120,80.12 0 top
U$15  106.83,44 180 top
X1  3.96,64.19 90 top
X17  3.96,22.03 90 top

### Tracks (layer width: path | path; a pad name or v marks a point on that pad's centre or on a via)
A0
  Top 0.152: IC1.78 59.92,49 57.3,51.62 35.2,51.62 33.8,53.02 24.79,53.02 12.22,65.59 12.22,73.08 14.15,75.02 A.1
A1
  Top 0.152: IC1.77 62.37,49.5 59.93,49.5 57.43,52 35.33,52 33.99,53.34 24.98,53.34 12.6,65.72 12.6,72.96 13.48,73.84 15.39,73.84 16.69,75.14 A.2
A2
  Top 0.152: IC1.76 59.94,49.99 57.55,52.38 35.46,52.38 34.19,53.65 25.17,53.65 14.15,64.67 B.1
A3
  Top 0.152: IC1.75 64.01,52.41 63.65,52.76 35.58,52.76 34.38,53.97 25.36,53.97 16.69,62.64 B.2
A4
  Top 0.152: IC1.74 64.49,52.38 63.73,53.14 35.71,53.14 31.92,56.93 IC4.1
A5
  Top 0.152: IC4.2 33.19,56.93 36.6,53.52 63.9,53.52 65,52.43 IC1.73
A6
  Top 0.152: IC4.3 34.46,56.93 37.49,53.91 64.03,53.91 65.5,52.43 IC1.72
A7
  Top 0.152: IC4.4 35.73,56.93 38.38,54.29 64.16,54.29 66.01,52.43 IC1.71
C0
  Top 0.152: IC1.53 75,52.81 76.35,54.16 99.21,54.16 101.73,56.68 IC5.4
C1
  Top 0.152: IC1.54 74.5,52.81 76.22,54.54 98.32,54.54 100.46,56.68 IC5.3
C2
  Top 0.152: IC1.55 73.99,52.81 76.1,54.92 97.43,54.92 99.19,56.68 IC5.2
C3
  Top 0.152: IC1.56 73.5,52.84 75.97,55.3 96.54,55.3 97.92,56.68 IC5.1
C4
  Top 0.152: IC1.57 73,52.84 77.49,57.34 77.49,65.34 79.78,67.62 81.56,67.62 82.69,68.75 F.2
C5
  Top 0.152: IC1.58 72.49,52.84 77.11,57.46 77.11,65.46 80.16,68.51 F.1
C6
  Top 0.152: IC1.59 72.01,52.87 76.73,57.59 76.73,71.18 79.4,73.84 81.43,73.84 82.7,75.11 82.69,75.12 E.2
C7
  Top 0.152: IC1.60 71.5,52.87 76.35,57.72 76.35,71.31 80.16,75.11 E.1
CAN_H  (via drill 0.35)
  Top 0.152: IC2.7 35.71,47.43 35.2,47.94 33.17,47.94 TERM.2 | X17.2 5.61,23.68 10.38,23.68 15.39,28.69 15.39,30.41 J1.8 18.82,33.84 18.82,44.38 | v19.45,44.63 19.2,44.38 18.82,44.38 | 18.82,44.38 16.66,46.54 J2.8
  Bottom 0.152: TERM.2 33.17,46.67 31.52,45.02 19.84,45.02 v19.45,44.63
CAN_L  (via drill 0.35)
  Top 0.152: R3.1 37.62,48.14 36.98,47.51 IC2.6 36.98,45.27 36.34,44.63 v33.17,44.63 | 18.44,43.37 18.44,33.97 17.42,32.95 J1.7 15.01,32.06 15.01,28.76 10.25,24 5.61,24 4.09,25.53 X17.3 | 18.44,43.37 18.44,44.25 14.12,48.57 J2.7 | v18.18,43.37 18.44,43.37
  Bottom 0.152: v33.17,44.63 20.34,44.63 19.71,44 18.82,44 v18.18,43.37
CAN_V+
  Top 1.016: J2.6 J2.5 13.74,51.24 12.22,49.72 12.22,46.54 13.48,45.27 13.48,42.73 12.22,41.46 12.22,37.02 13.74,35.49 J1.5 J1.6
  Bottom 1.016: PWR.3 21.87,37.02 19.07,34.22 J1.6 J1.5 13.74,35.49 12.22,37.02 12.22,41.46 13.48,42.73 13.48,45.27 12.22,46.54 12.22,49.72 13.74,51.24 J2.5 J2.6
COM  (via drill 0.35)
  Top 0.305: IC7.10 31.92,21.75 v31.9,21.77 | IC6.10 97.92,21.75 v97.94,21.77 | IC5.10 108.1,67.88 v108.1,66.22
  Top 0.406: IC4.10 42.08,66.25 v42.06,66.22
  Bottom 0.305: v42.06,66.22 42.06,63.69 | v31.9,21.77 31.9,24.32 | v97.94,21.77 97.94,24.32 | v108.1,66.22 108.1,63.69
  Bottom 1.016: A.5 B.5 24.31,66.07 24.44,65.94 | C.5 D.5 57.3,63.69 | O.5 P.5 16.69,23.07 17.93,24.32 | M.5 N.5 49.68,24.32 | 49.68,24.32 31.9,24.32 25.55,24.32 | 25.55,24.32 17.93,24.32 | K.5 L.5 82.69,24.3 82.7,24.32 | I.5 J.5 115.69,20.54 111.91,24.32 97.94,24.32 82.7,24.32 | 82.7,24.32 78.25,24.32 77.62,23.68 62.38,23.68 61.74,24.32 49.68,24.32 | 57.3,63.69 42.06,63.69 26.69,63.69 24.44,65.94 | 57.3,63.69 90.32,63.69 | 90.32,63.69 108.1,63.69 119.53,63.69 123.31,67.47 H.5 G.5 | E.5 F.5 90.31,63.7 90.32,63.69 | 7.77,65.94 X1.2 | 7.77,65.94 24.44,65.94 | PWR.1 29.36,35.74 25.55,31.94 25.55,24.32 | 17.93,24.32 4.59,37.65 4.59,58.48 7.77,61.65 7.77,65.94
CS  (via drill 0.35)
  Top 0.152: v47.77,47.17 IC3.16 | IC1.19 73,37.19 72.54,37.65 v72.16,37.65
  Bottom 0.152: v47.77,47.17 48.41,47.81 52.86,47.81 63.52,37.14 71.52,37.14 72.03,37.65 v72.16,37.65
E0
  Top 0.152: IC1.2 64.49,34.14 68.86,29.78 84.22,29.78 90.31,23.69 L.2
E1
  Top 0.152: IC1.3 65,34.14 68.98,30.16 84.35,30.16 92.85,21.66 L.1
E2  (via drill 0.35)
  Top 0.152: IC1.4 65.5,34.14 69.11,30.54 84.48,30.54 94.77,20.25 v94.77,17.33
  Bottom 0.152: v94.77,17.33 94.77,15.3 93.25,13.78 92.09,13.78 K.2
E3  (via drill 0.35)
  Top 0.152: IC1.5 66.01,34.14 69.24,30.92 84.61,30.92 95.15,20.38 95.15,18.22 v95.4,17.96
  Bottom 0.152: v95.4,17.96 95.4,15.43 92.85,12.88 K.1
E4
  Top 0.152: IC1.6 66.5,34.17 69.36,31.3 98.56,31.3 99.19,30.66 IC6.8
E5
  Top 0.152: IC1.7 67,34.17 69.49,31.68 100.1,31.68 100.46,31.32 IC6.7
E6
  Top 0.152: IC1.8 67.51,34.17 69.62,32.06 100.99,32.06 101.73,31.32 IC6.6
E7
  Top 0.152: IC1.9 67.99,34.2 69.75,32.44 101.88,32.44 103,31.32 IC6.5
F0
  Top 0.152: IC1.97 60.42,39.5 59.2,38.28 59.2,21.9 61.36,19.74 61.36,17.2 59.84,15.68 M.1
F1
  Top 0.152: IC1.96 60.42,40.01 58.82,38.41 58.82,21.77 60.98,19.62 60.98,17.33 57.31,13.66 M.2
F2
  Top 0.152: IC1.95 60.4,40.49 58.44,38.54 58.44,21.65 59.85,20.24 N.1
F3
  Top 0.152: IC1.94 60.4,41 58.06,38.67 58.06,37.02 58.06,36.89 58.06,20 57.31,19.25 N.2
F4
  Top 0.152: IC1.93 60.4,41.51 57.68,38.79 57.68,37.14 53.24,32.7 43.46,32.7 42.08,31.32 IC7.1
F5
  Top 0.152: IC1.92 60.37,41.99 57.3,38.92 57.3,37.27 53.11,33.08 42.57,33.08 40.81,31.32 IC7.2
F6
  Top 0.152: IC1.91 60.37,42.5 56.92,39.05 56.92,37.4 52.98,33.46 41.68,33.46 39.54,31.32 IC7.3
F7
  Top 0.152: IC1.90 60.37,43.01 56.54,39.17 56.54,37.52 52.86,33.84 40.79,33.84 38.27,31.32 IC7.4
GND  (via drill 0.35, 3.2)
  other vias: 4,76 70,76 136,76 136,12 70,12 4,12 64.28,39.55 64.28,47.17 68.09,43.37 70,44.63 71.91,44.63 69.75,42.48 68.73,39.55 76.98,37.02 71.91,47.81 75.72,48.45 71.91,50.35 76.35,50.35 66.83,50.35 66.83,47.81 70,50.35 70,47.81 58.82,48.45 97.31,49.72 98.58,41.46 83.59,47.43 61.74,32.57 55.14,46.79 62.76,51.87 59.84,51.11 56.92,50.86 45.87,50.86 38.12,50.98 32.79,54.8 43.71,57.21 46.5,58.73 57.43,58.73 66.7,57.34 30.63,59.88 23.01,48.45 23.01,47.17 30.63,47.17 30.63,48.45 21.1,59.24 26.19,55.43 11.58,67.88 12.22,62.41 17.3,63.05 17.93,67.88 28.73,66.22 29.36,70.03 36.34,70.67 36.34,66.22 23.65,52.89 27.45,51.62 26.19,51.62 19.2,55.43 26.19,44 27.45,44 64.28,45.27 40.79,44.51 39.52,41.33 48.41,41.33 54.76,41.33 59.2,42.73 38.25,32.57 42.7,37.65 44.6,34.48 43.33,31.3 52.22,31.94 57.3,35.74 59.84,35.74 35.08,34.48 32.53,31.94 36.34,37.65 27.45,31.94 26.82,25.59 30.63,25.59 33.17,21.77 59.84,25.59 59.84,23.05 57.3,23.05 57.3,25.59 34.44,14.79 37.62,17.96 40.79,14.79 44.6,17.33 44.6,21.77 42.06,21.77 29.36,12.89 18.56,23.05 25.55,23.05 12.22,15.43 13.48,30.66 14.12,25.59 12.22,23.68 7.13,24.95 19.84,43.37 19.45,45.78 15.14,45.4 11.96,52.38 19.84,49.72 23.01,43.37 40.79,47.05 8.79,52.38 8.79,36.51 11.96,33.97 14.12,47.17 14.76,42.09 43.97,75.11 45.23,70.67 29.36,77.02 36.34,62.41 45.23,62.41 44.6,65.59 40.79,64.95 42.06,62.41 47.14,64.95 75.08,40.19 75.72,42.73 69.62,34.35 63.02,33.84 66.19,30.66 75.72,28.76 83.97,28.76 86.51,30.03 80.8,36.38 76.98,35.87 78.89,35.87 96.03,36.38 110.64,36.38 107.47,33.2 96.67,30.66 124.61,23.68 120.8,23.68 103.66,17.96 99.84,14.16 107.47,14.16 110,17.96 97.31,17.96 77.62,56.06 96.03,56.06 101.75,54.8 77.62,53.52 96.03,53.52 106.29,50.45 101.11,44.63 125.25,45.91 122.07,48.45 111.28,60.51 108.1,60.51 102.38,70.67 106.19,73.84 98.58,73.84 96.03,70.03 111.28,70.67 118.9,64.95 120.16,62.41 89.05,64.95 91.59,64.95 90.32,62.41 56.03,64.95 58.57,64.95 57.3,62.41 23.01,67.24 23.65,64.32 83.97,23.05 81.43,23.05 82.7,25.59 111.28,23.05 112.55,25.59 50.95,23.05 48.41,23.05 49.68,25.59 15.39,23.05 18.56,25.59 24.28,25.59 28.73,21.77 71.27,54.16 75.72,57.97 77.62,67.5 78.25,64.95 78.25,62.41 75.72,62.41 75.72,64.95 102.38,46.54
  pour Top: -0.48,7.17 140.49,7.17 140.49,80.83 -0.48,80.83
  pour Bottom: -0.48,7.17 140.49,7.17 140.49,80.83 -0.48,80.83
H0
  Top 0.152: IC1.12 69.49,35.49 72.16,32.82 102.77,32.82 104.27,31.32 IC6.4
H1
  Top 0.152: IC1.13 70,35.49 72.29,33.2 103.66,33.2 105.54,31.32 IC6.3
H2
  Top 0.152: IC1.14 70.51,35.49 72.41,33.59 74.44,33.59 74.7,33.59 104.54,33.59 106.81,31.32 IC6.2
H3
  Top 0.152: IC1.15 70.99,35.52 72.54,33.97 105.43,33.97 108.08,31.32 IC6.1
H4
  Top 0.152: IC1.16 71.5,35.52 72.67,34.35 111.4,34.35 123.31,22.44 J.2
H5
  Top 0.152: IC1.17 72.01,35.52 72.79,34.73 75.08,34.73 75.21,34.73 111.53,34.73 125.85,20.41 J.1
H6
  Top 0.152: IC1.18 72.49,35.54 72.92,35.11 111.66,35.11 126.9,19.87 126.9,16.19 123.31,12.6 I.2
H7
  Top 0.152: IC1.27 78.69,38.49 79.53,37.65 79.53,36.38 80.41,35.49 111.78,35.49 127.28,20 127.28,16.06 125.85,14.63 I.1
INT  (via drill 0.35)
  Top 0.152: IC1.45 75.28,47.51 73.94,46.16 v72.79,46.16 | v57.17,47.43 53.36,47.43 52.86,47.94 IC3.12
  Bottom 0.152: v57.17,47.43 57.3,47.43 58.57,46.16 v72.79,46.16
J0
  Top 0.152: IC1.63 70,52.51 64.67,57.84 46.25,57.84 44.47,59.62 44.47,63.43 49.69,68.65 D.2
J1
  Top 0.152: IC1.64 69.49,52.51 64.54,57.46 46.12,57.46 44.09,59.49 44.09,63.56 47.15,66.62 D.1
J2  (via drill 0.35)
  Top 0.152: IC1.65 69.01,52.48 64.41,57.08 46,57.08 43.71,59.37 43.71,69.53 43.97,69.78 v43.97,70.67
  Bottom 0.152: v43.97,70.67 43.97,71.31 46.76,74.1 48.66,74.1 49.69,75.12 C.2
J3  (via drill 0.35)
  Top 0.152: IC1.66 68.5,52.48 64.28,56.7 45.87,56.7 43.33,59.24 v43.33,70.03
  Bottom 0.152: v43.33,70.03 43.33,71.18 47.15,75 C.1
J4
  Top 0.152: IC1.67 67.99,52.48 64.16,56.32 41.42,56.32 40.81,56.93 IC4.8
J5
  Top 0.152: IC1.68 67.51,52.46 64.03,55.94 40.54,55.94 39.54,56.93 IC4.7
J6
  Top 0.152: IC1.69 67,52.46 63.9,55.56 39.65,55.56 38.27,56.93 IC4.6
J7  (via drill 0.35)
  Top 0.152: IC1.79 63.57,48.5 v64.16,49.08 | IC4.5 37,56.93 38.76,55.18 58.19,55.18 v58.44,54.92
  Bottom 0.152: v64.16,49.08 64.16,49.21 v58.44,54.92
K0
  Top 0.152: IC1.89 59.08,43.49 58.19,42.6 46.12,42.6 37,33.48 IC7.5
K1
  Top 0.152: IC1.88 59.08,44 58.06,42.98 46,42.98 35.71,32.7 35.71,29.92 IC7.6
K2
  Top 0.152: IC7.7 34.46,31.95 45.87,43.37 57.94,43.37 59.08,44.51 IC1.87
K3
  Top 0.152: IC7.8 33.19,31.19 45.74,43.75 57.81,43.75 59.05,44.99 IC1.86
K4  (via drill 0.35)
  Top 0.152: IC1.85 59.05,45.5 57.68,44.13 45.62,44.13 36.73,35.24 34.19,35.24 29.87,30.92 29.87,18.47 30.12,18.22 v30.12,17.33
  Bottom 0.152: v30.12,17.33 30.12,16.19 26.82,12.89 26.82,12.03 O.1
K5  (via drill 0.35)
  Top 0.152: IC1.84 59.05,46.01 57.55,44.51 45.49,44.51 36.6,35.62 34.06,35.62 29.49,31.05 v29.49,17.96
  Bottom 0.152: v29.49,17.96 29.49,16.06 27.33,13.91 26.22,13.91 O.2
K6
  Top 0.152: IC1.83 59.03,46.49 57.43,44.89 45.36,44.89 36.47,36 33.93,36 29.11,31.17 29.11,23.8 26.85,21.55 P.1
K7
  Top 0.152: IC1.82 59.03,47 57.3,45.27 45.23,45.27 36.34,36.38 33.8,36.38 28.73,31.3 28.73,23.93 24.31,19.52 P.2
L0
  Top 0.152: IC1.35 78.66,42.5 79.02,42.86 97.18,42.86 110.51,56.19 110.51,65.59 112.55,67.62 114.58,67.62 115.69,68.73 H.2
L1
  Top 0.152: IC1.36 78.66,43.01 78.89,43.24 97.05,43.24 110.13,56.32 110.13,65.72 113.15,68.73 H.1
L2  (via drill 0.35)
  Top 0.152: IC1.37 78.64,43.49 78.76,43.62 96.92,43.62 109.75,56.45 109.75,69.15 110,69.4 v110,70.67
  Bottom 0.152: v110,70.67 110,71.43 112.55,73.97 114.58,73.97 115.69,75.09 G.2
L3  (via drill 0.35)
  Top 0.152: v109.37,70.03 109.37,56.57 96.8,44 IC1.38
  Bottom 0.152: v109.37,70.03 109.37,71.31 113.15,75.09 G.1
L4
  Top 0.152: IC5.8 106.81,54.52 96.67,44.38 82.83,44.38 82.7,44.38 78.76,44.38 78.64,44.51 IC1.39
L5
  Top 0.152: IC5.7 105.54,53.76 96.54,44.76 78.89,44.76 78.66,44.99 IC1.40
L6
  Top 0.152: IC5.6 104.27,53 96.42,45.14 79.02,45.14 78.66,45.5 IC1.41
L7
  Top 0.152: IC5.5 103,52.23 96.29,45.52 81.56,45.52 81.43,45.52 79.14,45.52 78.66,46.01 IC1.42
MISO  (via drill 0.35)
  Top 0.152: v49.05,47.17 IC3.15 | v74.57,38.16 74.57,38.03 74.5,37.95 IC1.22
  Bottom 0.152: v49.05,47.17 50.06,46.16 52.98,46.16 63.14,36 72.79,36 | v74.57,38.16 74.57,37.78 72.79,36 | ISP.1 72.79,29.01 72.79,36
MOSI  (via drill 0.35)
  Top 0.152: v50.31,47.17 IC3.14 | v73.68,38.28 73.99,37.98 IC1.21
  Bottom 0.152: v50.31,47.17 50.95,46.54 53.11,46.54 63.27,36.38 72.54,36.38 73.68,37.52 v73.68,38.28 74.19,38.79 74.83,38.79 75.21,38.41 75.21,37.9 73.17,35.87 73.17,29.52 73.56,29.14 73.56,25.71 73.05,25.2 71.02,25.2 ISP.4
N$1
  Top 0.406: B.4 21.77,70.7 23.65,72.58 29.99,72.58 33.19,69.38 IC4.17
N$2
  Top 0.406: B.6 26.85,70.7 28.09,71.94 29.36,71.94 31.92,69.38 IC4.18
N$3
  Top 0.406: A.4 21.77,75.09 23.65,73.21 30.63,73.21 34.46,69.38 IC4.16
N$4
  Top 0.406: A.6 26.85,75.09 28.09,73.84 31.27,73.84 35.73,69.38 IC4.15
N$5
  Top 0.406: C.4 54.77,75.12 53.49,73.84 41.42,73.84 36.98,69.4 37,69.38 IC4.14
N$6
  Top 0.406: C.6 59.85,75.12 57.94,73.21 42.06,73.21 38.25,69.4 38.27,69.38 IC4.13
N$7
  Top 0.406: D.6 59.85,70.66 57.94,72.58 42.7,72.58 39.52,69.4 39.54,69.38 IC4.12
N$8
  Top 0.406: D.4 54.77,70.66 53.49,71.94 43.33,71.94 40.79,69.4 40.81,69.38 IC4.11
N$9
  Top 0.406: F.6 92.85,70.66 94.13,71.94 95.4,71.94 97.92,69.42 IC5.18
N$10
  Top 0.406: F.4 87.77,70.66 89.69,72.58 96.03,72.58 99.19,69.42 IC5.17
N$11
  Top 0.406: E.6 92.85,75.12 94.13,73.84 97.31,73.84 101.75,69.4 101.73,69.38 IC5.15
N$12
  Top 0.406: E.4 87.77,75.12 89.69,73.21 96.67,73.21 100.46,69.42 IC5.16
N$13
  Top 0.406: G.4 120.77,75.09 119.53,73.84 107.47,73.84 103,69.38 IC5.14
N$14
  Top 0.406: G.6 125.85,75.09 123.97,73.21 108.1,73.21 104.27,69.38 IC5.13
N$15
  Top 0.406: H.6 125.85,70.7 123.97,72.58 108.73,72.58 105.54,69.38 IC5.12
N$16
  Top 0.406: H.4 120.77,70.7 119.53,71.94 109.37,71.94 106.81,69.38 IC5.11
N$17
  Top 0.152: IC1.47 86.46,48.5 87.14,47.81 SW1.4
N$18
  Top 0.152: IC1.48 86.43,49 86.89,49.46 90.07,49.46 90.95,48.57 SW1.3
N$19
  Top 0.152: IC1.49 86.31,49.51 86.64,49.84 92.22,49.84 93.5,48.57 SW1.2
N$20
  Top 0.152: IC1.50 86.15,49.99 86.38,50.22 94.38,50.22 96.03,48.57 SW1.1
N$21
  Bottom 0.152: J1.1 15.52,41.97 15.52,43.62 17.93,46.03 17.93,53.27 17.17,54.03 16.28,54.03 14.12,56.19 J2.1
N$23
  Top 0.406: L.6 80.15,17.34 82.06,15.43 97.31,15.43 100.46,18.58 IC6.12
N$24
  Top 0.406: P.6 14.15,17.3 16.02,15.43 31.27,15.43 34.46,18.62 IC7.12
N$25
  Top 0.406: L.4 85.23,17.34 86.51,16.06 96.67,16.06 99.19,18.58 IC6.11
N$26
  Top 0.406: I.4 118.23,12.91 116.35,14.79 109.37,14.79 105.54,18.62 IC6.16
N$27
  Top 0.406: I.6 113.15,12.91 111.91,14.16 108.73,14.16 104.27,18.62 IC6.15
N$28
  Top 0.406: K.4 85.23,12.88 86.51,14.16 98.58,14.16 103,18.58 IC6.14
N$29
  Top 0.406: K.6 80.15,12.88 82.06,14.79 97.94,14.79 101.73,18.58 IC6.13
N$30
  Top 0.406: J.4 118.23,17.3 116.35,15.43 110,15.43 106.81,18.62 IC6.17
N$31
  Top 0.406: J.6 113.15,17.3 111.91,16.06 110.64,16.06 108.08,18.62 IC6.18
N$32
  Top 0.406: P.4 19.23,17.3 20.47,16.06 30.63,16.06 33.19,18.62 IC7.11
N$33
  Top 0.406: N.4 52.23,17.34 50.31,15.43 43.97,15.43 40.81,18.58 IC7.17
N$34
  Top 0.406: M.4 52.23,12.88 50.31,14.79 43.33,14.79 39.54,18.58 IC7.16
N$35
  Top 0.406: M.6 47.15,12.88 45.87,14.16 42.7,14.16 38.27,18.58 IC7.15
N$36
  Top 0.406: O.4 19.23,12.91 20.47,14.16 32.53,14.16 37,18.62 IC7.14
N$37
  Top 0.406: O.6 14.15,12.91 16.02,14.79 31.9,14.79 35.73,18.62 IC7.13
N$38
  Top 0.406: N.6 47.15,17.34 45.87,16.06 44.6,16.06 42.08,18.58 IC7.18
N$39
  Bottom 0.152: J1.2 15.9,40.06 15.9,43.49 18.31,45.91 18.31,53.4 J2.2
N$133
  Top 0.152: R4.1 POWER.C
N$134
  Top 0.152: R3.2 35.84,49.58 TERM.1
N$137
  Top 0.152: R5.1 STATUS.C
OSC1
  Top 0.152: C7.1 47.64,35.35 Q2.1 48.8,36 52.35,36 52.85,35.5 R2.1 54.12,36.77 IC3.8
OSC2
  Top 0.152: Q2.3 50.45,36.65 C8.1 51.73,36.5 R2.2 IC3.7
RESET  (via drill 0.35)
  Top 0.152: v75.97,39.05 75.97,39.3 76.68,40.01 IC1.30 | v46.5,47.17 IC3.17 | v74.57,29.14 73.17,27.74 68.48,27.74 ISP.5 67.46,30.66 63.52,34.61 v63.52,35.24 R8.1 | v84.86,41.84 85.11,42.09 97.43,42.09 101.09,45.75 U$15.P$3 U$15.P$4
  Bottom 0.152: v46.5,47.17 47.9,45.78 52.86,45.78 63.39,35.24 v63.52,35.24 | v74.57,29.14 73.94,29.78 73.94,35.62 75.97,37.65 v75.97,39.05 78,41.08 84.1,41.08 v84.86,41.84
RXCAN  (via drill 0.35)
  Top 0.152: IC3.2 v46.5,40.83 | v38.25,40.19 IC2.4
  Bottom 0.152: v46.5,40.83 45.23,39.55 38.89,39.55 v38.25,40.19
SCK  (via drill 0.35)
  Top 0.152: v51.59,47.17 IC3.13 | v72.79,38.28 72.79,38.16 73.5,37.45 IC1.20
  Bottom 0.152: v51.59,47.17 52.98,47.17 63.4,36.76 72.41,36.76 72.79,37.14 v72.79,38.28 73.68,39.17 74.95,39.17 75.59,38.54 75.59,37.78 73.56,35.74 73.56,29.65 73.94,29.27 73.94,25.59 73.17,24.82 69.87,24.82 68.98,25.71 68.98,27.74 ISP.3
SCL  (via drill 0.35)
  Top 0.152: IC1.43 76.05,46.49 75.84,46.29 v74.95,46.29 | R6.1 71.27,59.24 70,60.51 I²C.2
  Bottom 0.152: v74.95,46.29 74.95,47.05 74.06,47.94 74.06,56.45 70,60.51 I²C.2
SDA  (via drill 0.35)
  Top 0.152: IC1.44 75.66,47 v75.59,46.92 | R7.1 I²C.1
  Bottom 0.152: v75.59,46.92 74.44,48.06 74.44,56.57 72.54,58.48 I²C.1
STATUS  (via drill 0.35)
  Top 0.152: IC1.46 79.35,47.99 81.43,45.91 96.16,45.91 97.31,47.05 v97.31,47.43 | STATUS.A 119.05,45.95 117.46,47.54 103.64,47.54 v103.38,47.79
  Bottom 0.152: v103.38,47.79 97.67,47.79 v97.31,47.43
TXCAN  (via drill 0.35)
  Top 0.152: IC3.1 44.85,38.92 v43.97,38.92 | v37.62,39.17 35.51,39.17 34.44,40.24 IC2.1
  Bottom 0.152: v43.97,38.92 43.71,39.17 v37.62,39.17
V+
  Top 1.016: PWR.2 26.82,39.55 25.91,40.47 IC8.1 21.97,40.47 C9.+
VCC  (via drill 0.35)
  Top 0.152: C1.1 62.23,36.39 R8.2 IC1.100 | v83.34,42.22 83.59,42.48 97.31,42.48 101.99,47.16 117.34,47.16 118,46.5 118,44 118.05,44 POWER.A | R7.2 R6.2 70.15,55.56 C2.1
  Top 0.305: IC1.100 64.01,38.01 66.51,40.51 | 66.51,40.51 69.36,43.37 | 69.36,43.37 64.74,47.99 IC1.80 59.38,47.99 57.3,45.91 45.23,45.91 IC3.18 45.23,49.08 45.22,49.09 C3.1 | IC1.31 76.05,40.49 v75.08,41.46 73.17,43.37 71.02,43.37 | 69.36,43.37 71.02,43.37 | 71.02,43.37 70.99,43.39 IC1.61 70.99,53.17 70,54.16 C2.1 | 66.51,40.51 68.5,38.51 IC1.10 68.5,34.32 69.75,33.08 v70.76,33.08 | C6.1 38.87,48.43 38.25,47.81 IC2.5 38.25,45.27 38.89,44.63 | IC2.3 36.98,44
  Top 0.406: 45.23,45.91 40.16,45.91 38.89,44.63 38.25,44 36.98,44 33.8,44 33.17,43.37 33.17,41.46 32.18,40.47 31.27,40.47 | IC8.2 31.27,40.47 | C10.1 31.27,40.47
  Bottom 0.152: v75.08,41.46 82.57,41.46 v83.34,42.22
  Bottom 0.305: v70.76,33.08 71.27,32.57 71.27,27.49 ISP.2
XTAL1
  Top 0.152: IC1.34 82.57,41.99 83.28,41.28 | 83.28,41.28 83.47,41.09 82.45,40.06 82.45,37.77 R1.1 | C4.1 83.85,40.84 Q1.1 83.34,41.34 83.28,41.28
XTAL2
  Top 0.152: R1.2 80.91,38.3 80.91,38.91 Q1.3 81.3,39.93 81.3,39.94 81.05,40.19 80.16,40.19 79.91,40.44 C5.1 79.78,40.84 79.11,41.51 IC1.33

### Text on the board
Top: MäCAN MP5x16 V1.0 - github.com/Ixam97
tPlace: A | C | E | G | B | D | F | H | 1 | 2 | - | poz1 | COM | poz2 | 1 | 2 | - | poz1 | COM | poz2 | 1 | 2 | - | poz1 | COM | poz2 | 1 | 2 | - | poz1 | COM | poz2 | GND | SCL | SDA | AUX | AUX | AUX | AUX | CAN | Ext | AUX | AUX | AUX | AUX | poz2 | COM | poz1 | - | 2 | 1 | poz2 | COM | poz1 | - | 2 | 1 | poz2 | COM | poz1 | - | 2 | 1 | poz2 | COM | poz1 | - | 2 | 1 | P | N | L | J | O | M | K | I
tNames: V+ | GND | Reset | MP5x16 V1.0 | Low | High | GND | JLCJLCJLCJLC